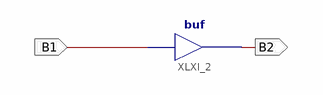
[diagram p0: schematic sheet 1]
// Xilinx ISE schematic Testmap.sch (spartan6) as structural Verilog: 1 symbols, 2 ports
module Testmap (
  input  B1,
  output B2
);

  buf XLXI_2 (B2, B1);
endmodule
